# EAGLE design XFader_Assign (EAGLE 6.5.0)
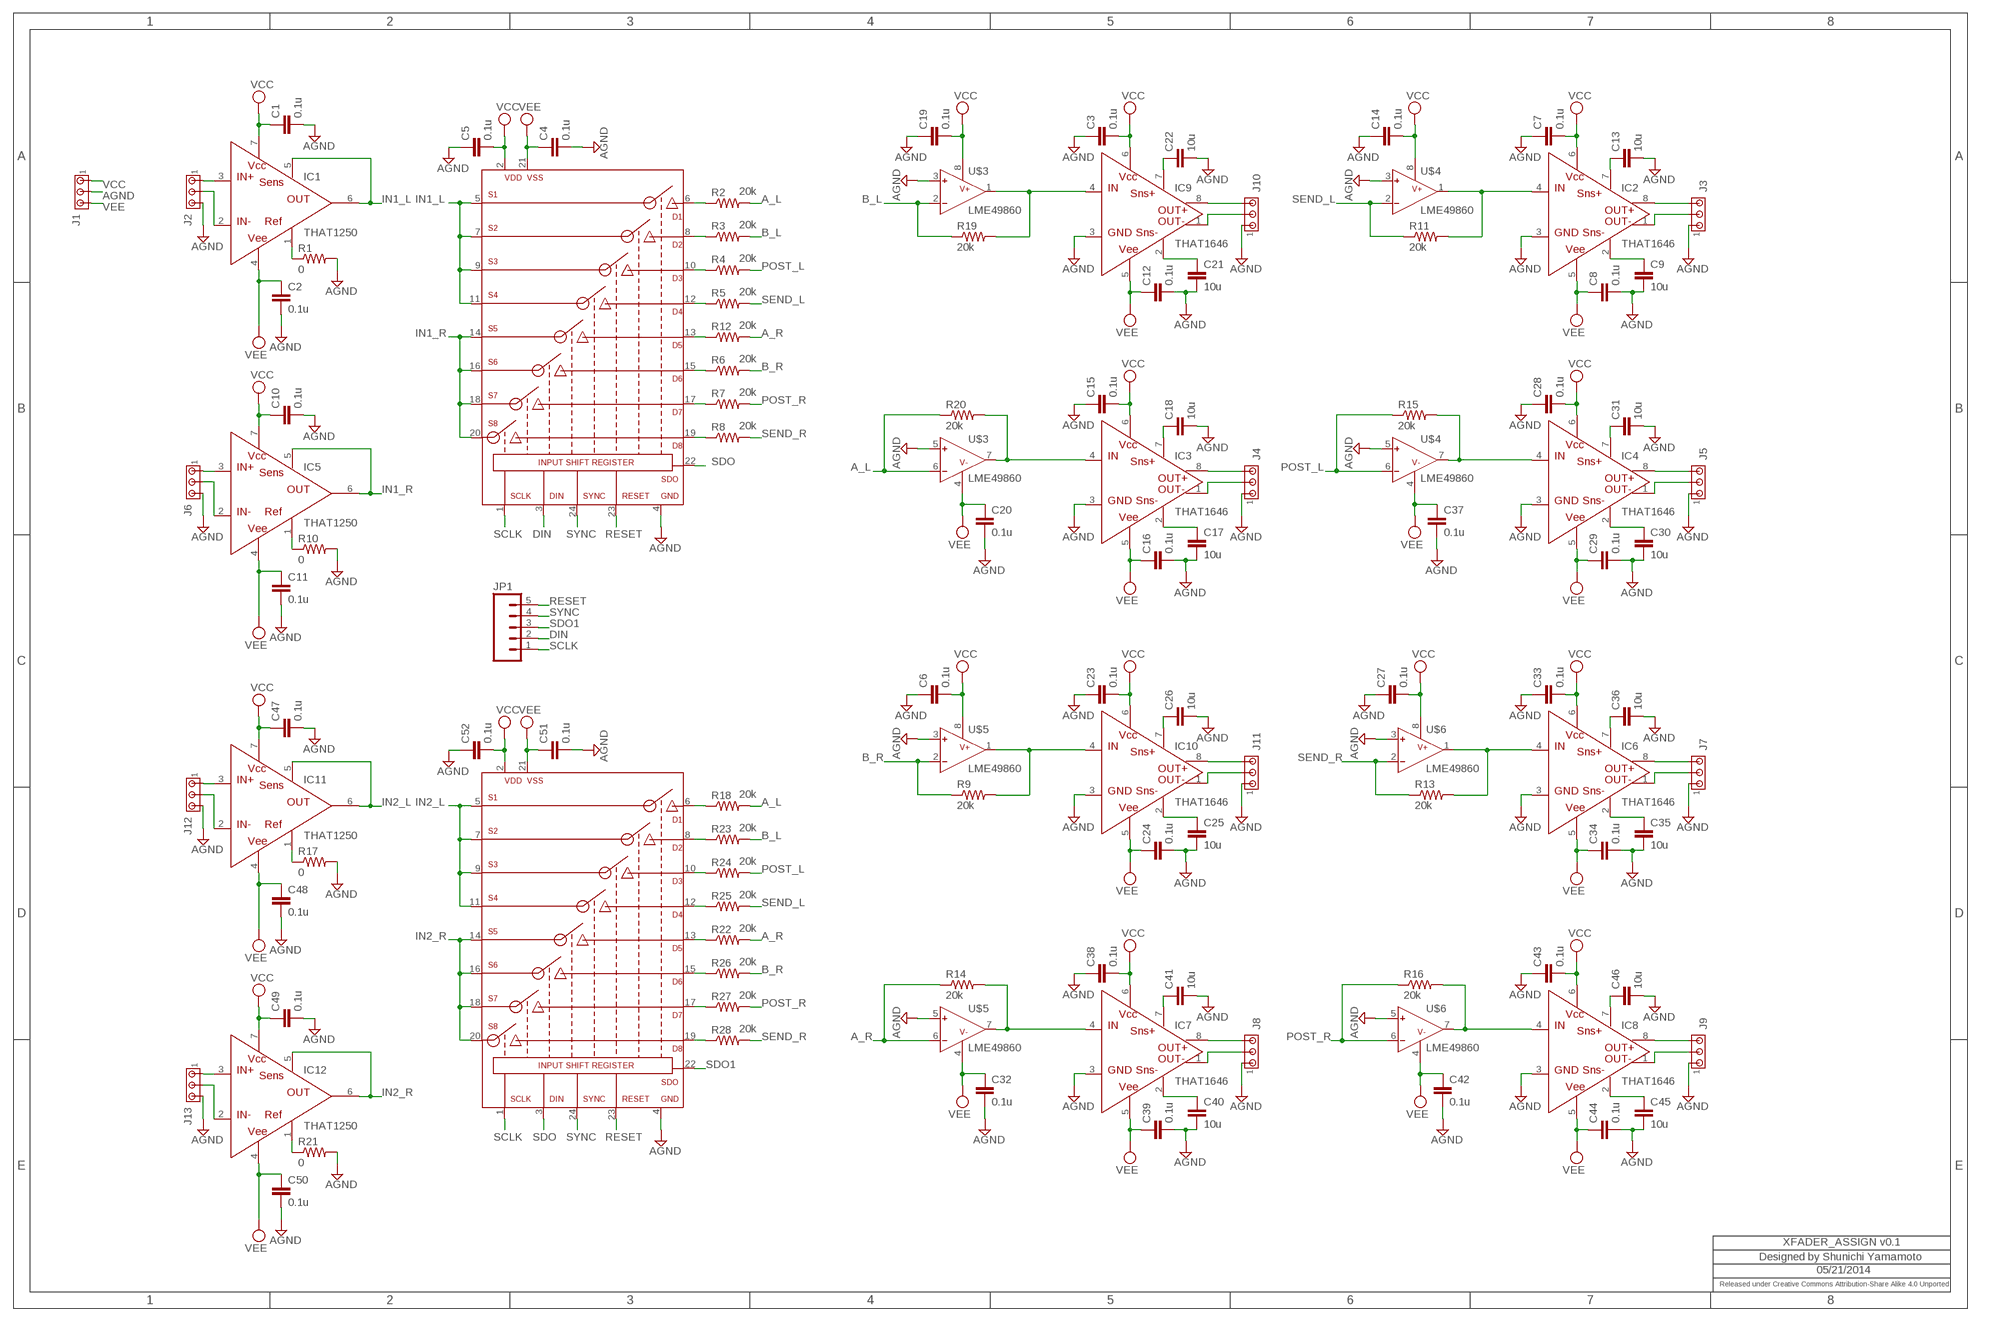
[diagram p0: schematic, sheet 1]

## Parts
C1  0.1u  C-EUC2012  [C2012]
C2  0.1u  C-EUC2012  [C2012]
C3  0.1u  C-EUC2012  [C2012]
C4  0.1u  C-EUC2012  [C2012]
C5  0.1u  C-EUC2012  [C2012]
C6  0.1u  C-EUC2012  [C2012]
C7  0.1u  C-EUC2012  [C2012]
C8  0.1u  C-EUC2012  [C2012]
C9  10u  C-EUC2012  [C2012]
C10  0.1u  C-EUC2012  [C2012]
C11  0.1u  C-EUC2012  [C2012]
C12  0.1u  C-EUC2012  [C2012]
C13  10u  C-EUC2012  [C2012]
C14  0.1u  C-EUC2012  [C2012]
C15  0.1u  C-EUC2012  [C2012]
C16  0.1u  C-EUC2012  [C2012]
C17  10u  C-EUC2012  [C2012]
C18  10u  C-EUC2012  [C2012]
C19  0.1u  C-EUC2012  [C2012]
C20  0.1u  C-EUC2012  [C2012]
C21  10u  C-EUC2012  [C2012]
C22  10u  C-EUC2012  [C2012]
C23  0.1u  C-EUC2012  [C2012]
C24  0.1u  C-EUC2012  [C2012]
C25  10u  C-EUC2012  [C2012]
C26  10u  C-EUC2012  [C2012]
C27  0.1u  C-EUC2012  [C2012]
C28  0.1u  C-EUC2012  [C2012]
C29  0.1u  C-EUC2012  [C2012]
C30  10u  C-EUC2012  [C2012]
C31  10u  C-EUC2012  [C2012]
C32  0.1u  C-EUC2012  [C2012]
C33  0.1u  C-EUC2012  [C2012]
C34  0.1u  C-EUC2012  [C2012]
C35  10u  C-EUC2012  [C2012]
C36  10u  C-EUC2012  [C2012]
C37  0.1u  C-EUC2012  [C2012]
C38  0.1u  C-EUC2012  [C2012]
C39  0.1u  C-EUC2012  [C2012]
C40  10u  C-EUC2012  [C2012]
C41  10u  C-EUC2012  [C2012]
C42  0.1u  C-EUC2012  [C2012]
C43  0.1u  C-EUC2012  [C2012]
C44  0.1u  C-EUC2012  [C2012]
C45  10u  C-EUC2012  [C2012]
C46  10u  C-EUC2012  [C2012]
C47  0.1u  C-EUC2012  [C2012]
C48  0.1u  C-EUC2012  [C2012]
C49  0.1u  C-EUC2012  [C2012]
C50  0.1u  C-EUC2012  [C2012]
C51  0.1u  C-EUC2012  [C2012]
C52  0.1u  C-EUC2012  [C2012]
IC1  THAT1250  [SOIC8@1]
IC2  THAT1646  [SOIC8]
IC3  THAT1646  [SOIC8]
IC4  THAT1646  [SOIC8]
IC5  THAT1250  [SOIC8@1]
IC6  THAT1646  [SOIC8]
IC7  THAT1646  [SOIC8]
IC8  THAT1646  [SOIC8]
IC9  THAT1646  [SOIC8]
IC10  THAT1646  [SOIC8]
IC11  THAT1250  [SOIC8@1]
IC12  THAT1250  [SOIC8@1]
J1  MTA03-156  [1X3MTA]
J2  MTA03-100  [10X03MTA]
J3  MTA03-100  [10X03MTA]
J4  MTA03-100  [10X03MTA]
J5  MTA03-100  [10X03MTA]
J6  MTA03-100  [10X03MTA]
J7  MTA03-100  [10X03MTA]
J8  MTA03-100  [10X03MTA]
J9  MTA03-100  [10X03MTA]
J10  MTA03-100  [10X03MTA]
J11  MTA03-100  [10X03MTA]
J12  MTA03-100  [10X03MTA]
J13  MTA03-100  [10X03MTA]
JP1  M05PTH  [1X05]
R1  0  RESISTOR0805-RES  [0805]
R2  20k  RESISTOR0805-RES  [0805]
R3  20k  RESISTOR0805-RES  [0805]
R4  20k  RESISTOR0805-RES  [0805]
R5  20k  RESISTOR0805-RES  [0805]
R6  20k  RESISTOR0805-RES  [0805]
R7  20k  RESISTOR0805-RES  [0805]
R8  20k  RESISTOR0805-RES  [0805]
R9  20k  RESISTOR0805-RES  [0805]
R10  0  RESISTOR0805-RES  [0805]
R11  20k  RESISTOR0805-RES  [0805]
R12  20k  RESISTOR0805-RES  [0805]
R13  20k  RESISTOR0805-RES  [0805]
R14  20k  RESISTOR0805-RES  [0805]
R15  20k  RESISTOR0805-RES  [0805]
R16  20k  RESISTOR0805-RES  [0805]
R17  0  RESISTOR0805-RES  [0805]
R18  20k  RESISTOR0805-RES  [0805]
R19  20k  RESISTOR0805-RES  [0805]
R20  20k  RESISTOR0805-RES  [0805]
R21  0  RESISTOR0805-RES  [0805]
R22  20k  RESISTOR0805-RES  [0805]
R23  20k  RESISTOR0805-RES  [0805]
R24  20k  RESISTOR0805-RES  [0805]
R25  20k  RESISTOR0805-RES  [0805]
R26  20k  RESISTOR0805-RES  [0805]
R27  20k  RESISTOR0805-RES  [0805]
R28  20k  RESISTOR0805-RES  [0805]
U$1  ADG1414  [TSSOP24]
U$2  ADG1414  [TSSOP24]
U$3  LME49860  [SOIC8]
U$4  LME49860  [SOIC8]
U$5  LME49860  [SOIC8]
U$6  LME49860  [SOIC8]

## Nets
A_L: R2.2 R18.2 R20.1 U$3.6(INB-)
A_R: R12.2 R14.1 R22.2 U$5.6(INB-)
AGND: C1.2 C2.2 C3.1 C4.2 C5.1 C6.1 C7.1 C8.2 C9.2 C10.2 C11.2 C12.2 C13.2 C14.1 C15.1 C16.2 C17.2 C18.2 C19.1 C20.2 C21.2 C22.2 C23.1 C24.2 C25.2 C26.2 C27.1 C28.1 C29.2 C30.2 C31.2 C32.2 C33.1 C34.2 C35.2 C36.2 C37.2 C38.1 C39.2 C40.2 C41.2 C42.2 C43.1 C44.2 C45.2 C46.2 C47.2 C48.2 C49.2 C50.2 C51.2 C52.1 IC2.3(GND) IC3.3(GND) IC4.3(GND) IC6.3(GND) IC7.3(GND) IC8.3(GND) IC9.3(GND) IC10.3(GND) J1.2 J2.3 J3.1 J4.1 J5.1 J6.3 J7.1 J8.1 J9.1 J10.1 J11.1 J12.3 J13.3 R1.2 R10.2 R17.2 R21.2 U$1.4(GND) U$2.4(GND) U$3.3(INA+) U$3.5(INB+) U$4.3(INA+) U$4.5(INB+) U$5.3(INA+) U$5.5(INB+) U$6.3(INA+) U$6.5(INB+)
B_L: R3.2 R19.1 R23.2 U$3.2(INA-)
B_R: R6.2 R9.1 R26.2 U$5.2(INA-)
DIN: JP1.2 U$1.3(DIN)
IN1_L: IC1.5(SENS) IC1.6(OUT) U$1.5(S1) U$1.7(S2) U$1.9(S3) U$1.11(S4)
IN1_R: IC5.5(SENS) IC5.6(OUT) U$1.14(S5) U$1.16(S6) U$1.18(S7) U$1.20(S8)
IN2_L: IC11.5(SENS) IC11.6(OUT) U$2.5(S1) U$2.7(S2) U$2.9(S3) U$2.11(S4)
IN2_R: IC12.5(SENS) IC12.6(OUT) U$2.14(S5) U$2.16(S6) U$2.18(S7) U$2.20(S8)
MGAIN_L1: IC10.4(IN) R9.2 U$5.1(OUTA)
MGAIN_L2: IC9.4(IN) R19.2 U$3.1(OUTA)
MGAIN_L3: IC2.4(IN) R11.2 U$4.1(OUTA)
MGAIN_L4: IC6.4(IN) R13.2 U$6.1(OUTA)
MGAIN_R: IC3.4(IN) R20.2 U$3.7(OUTB)
MGAIN_R1: IC7.4(IN) R14.2 U$5.7(OUTB)
MGAIN_R2: IC4.4(IN) R15.2 U$4.7(OUTB)
MGAIN_R3: IC8.4(IN) R16.2 U$6.7(OUTB)
N$1: IC1.1(REF) R1.1
N$2: R2.1 U$1.6(D1)
N$3: IC1.3(IN+) J2.1
N$4: IC1.2(IN-) J2.2
N$5: R12.1 U$1.13(D5)
N$6: R3.1 U$1.8(D2)
N$7: R4.1 U$1.10(D3)
N$8: R5.1 U$1.12(D4)
N$9: R6.1 U$1.15(D6)
N$10: R7.1 U$1.17(D7)
N$11: R8.1 U$1.19(D8)
N$12: C13.1 IC2.7(SNS+)
N$13: IC5.1(REF) R10.1
N$14: IC5.3(IN+) J6.1
N$15: IC5.2(IN-) J6.2
N$16: C9.1 IC2.2(SNS-)
N$17: IC2.8(OUT+) J3.3
N$18: IC2.1(OUT-) J3.2
N$19: C18.1 IC3.7(SNS+)
N$20: C17.1 IC3.2(SNS-)
N$21: IC3.8(OUT+) J4.3
N$22: IC3.1(OUT-) J4.2
N$23: C31.1 IC4.7(SNS+)
N$24: C30.1 IC4.2(SNS-)
N$25: C22.1 IC9.7(SNS+)
N$26: IC9.8(OUT+) J10.3
N$27: IC9.1(OUT-) J10.2
N$28: C26.1 IC10.7(SNS+)
N$29: C25.1 IC10.2(SNS-)
N$30: IC10.8(OUT+) J11.3
N$31: IC10.1(OUT-) J11.2
N$32: IC4.8(OUT+) J5.3
N$33: IC4.1(OUT-) J5.2
N$34: C21.1 IC9.2(SNS-)
N$35: C36.1 IC6.7(SNS+)
N$36: C35.1 IC6.2(SNS-)
N$37: IC6.8(OUT+) J7.3
N$38: IC6.1(OUT-) J7.2
N$39: C41.1 IC7.7(SNS+)
N$40: C40.1 IC7.2(SNS-)
N$41: IC7.8(OUT+) J8.3
N$42: IC7.1(OUT-) J8.2
N$43: C46.1 IC8.7(SNS+)
N$44: C45.1 IC8.2(SNS-)
N$45: IC8.8(OUT+) J9.3
N$46: IC8.1(OUT-) J9.2
N$47: IC11.1(REF) R17.1
N$48: IC11.3(IN+) J12.1
N$49: IC11.2(IN-) J12.2
N$50: IC12.1(REF) R21.1
N$51: IC12.3(IN+) J13.1
N$52: IC12.2(IN-) J13.2
N$53: R18.1 U$2.6(D1)
N$54: R22.1 U$2.13(D5)
N$55: R23.1 U$2.8(D2)
N$56: R24.1 U$2.10(D3)
N$57: R25.1 U$2.12(D4)
N$58: R26.1 U$2.15(D6)
N$59: R27.1 U$2.17(D7)
N$60: R28.1 U$2.19(D8)
POST_L: R4.2 R15.1 R24.2 U$4.6(INB-)
POST_R: R7.2 R16.1 R27.2 U$6.6(INB-)
RESET: JP1.5 U$1.23(RESET) U$2.23(RESET)
SCLK: JP1.1 U$1.1(SCLK) U$2.1(SCLK)
SDO: U$1.22(SDO) U$2.3(DIN)
SDO1: JP1.3 U$2.22(SDO)
SEND_L: R5.2 R11.1 R25.2 U$4.2(INA-)
SEND_R: R8.2 R13.1 R28.2 U$6.2(INA-)
SYNC: JP1.4 U$1.24(SYNC) U$2.24(SYNC)
VCC: C1.1 C3.2 C5.2 C6.2 C7.2 C10.1 C14.2 C15.2 C19.2 C23.2 C27.2 C28.2 C33.2 C38.2 C43.2 C47.1 C49.1 C52.2 IC1.7(VCC) IC2.6(VCC) IC3.6(VCC) IC4.6(VCC) IC5.7(VCC) IC6.6(VCC) IC7.6(VCC) IC8.6(VCC) IC9.6(VCC) IC10.6(VCC) IC11.7(VCC) IC12.7(VCC) J1.1 U$1.2(VDD) U$2.2(VDD) U$3.8(V+) U$4.8(V+) U$5.8(V+) U$6.8(V+)
VEE: C2.1 C4.1 C8.1 C11.1 C12.1 C16.1 C20.1 C24.1 C29.1 C32.1 C34.1 C37.1 C39.1 C42.1 C44.1 C48.1 C50.1 C51.1 IC1.4(VEE) IC2.5(VEE) IC3.5(VEE) IC4.5(VEE) IC5.4(VEE) IC6.5(VEE) IC7.5(VEE) IC8.5(VEE) IC9.5(VEE) IC10.5(VEE) IC11.4(VEE) IC12.4(VEE) J1.3 U$1.21(VSS) U$2.21(VSS) U$3.4(V-) U$4.4(V-) U$5.4(V-) U$6.4(V-)

## Notes on the sheet
- XFADER_ASSIGN v0.1
- Designed by Shunichi Yamamoto
- 05/21/2014
- Released under Creative Commons Attribution-Share Alike 4.0 Unported

## Library data of the parts
C1-C52 = rcl:C-EU: CAPACITOR, European symbol
IC1 IC5 IC11 IC12 = thatcorp:THAT1250
IC2-IC4 IC6-IC10 = thatcorp:THAT1646
J1 = con-amp:MTA03-156: AMP connector
J2-J13 = con-amp:MTA03-100: AMP connector
JP1 = SparkFun:M05: Header 5 Standard 5-pin 0.1" header. Use with straight break away headers (SKU : PRT-00116), right angle break away headers (PRT-00553), swiss pins (PRT-00743), machine pins (PRT-00117), and female headers (PRT-00115). Molex polarized connector foot print use with SKU : PRT-08230 with associated crimp pins and housings.
R1-R28 = SparkFun:RESISTOR: Resistor Basic schematic elements and footprints for 0603, 1206, and PTH resistors.
U$1 U$2 = thatcorp:ADG1414
U$3-U$6 = thatcorp:LME49860

## Board
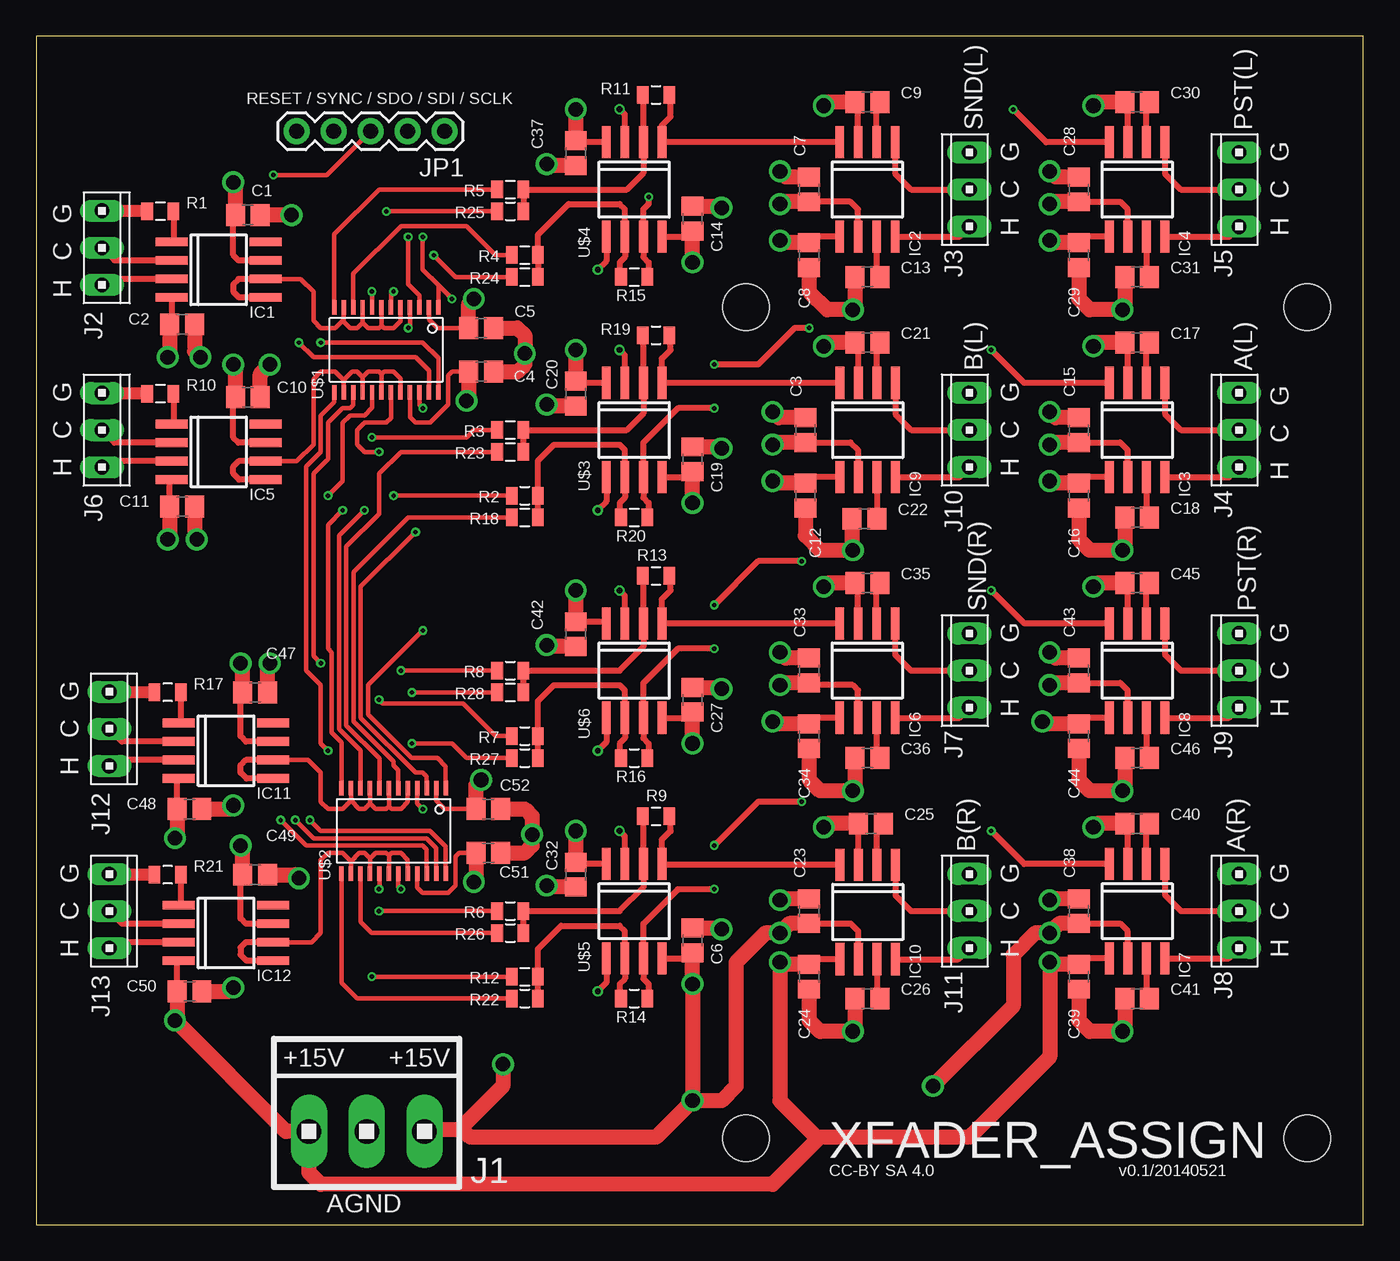
[diagram p1: board, top side]
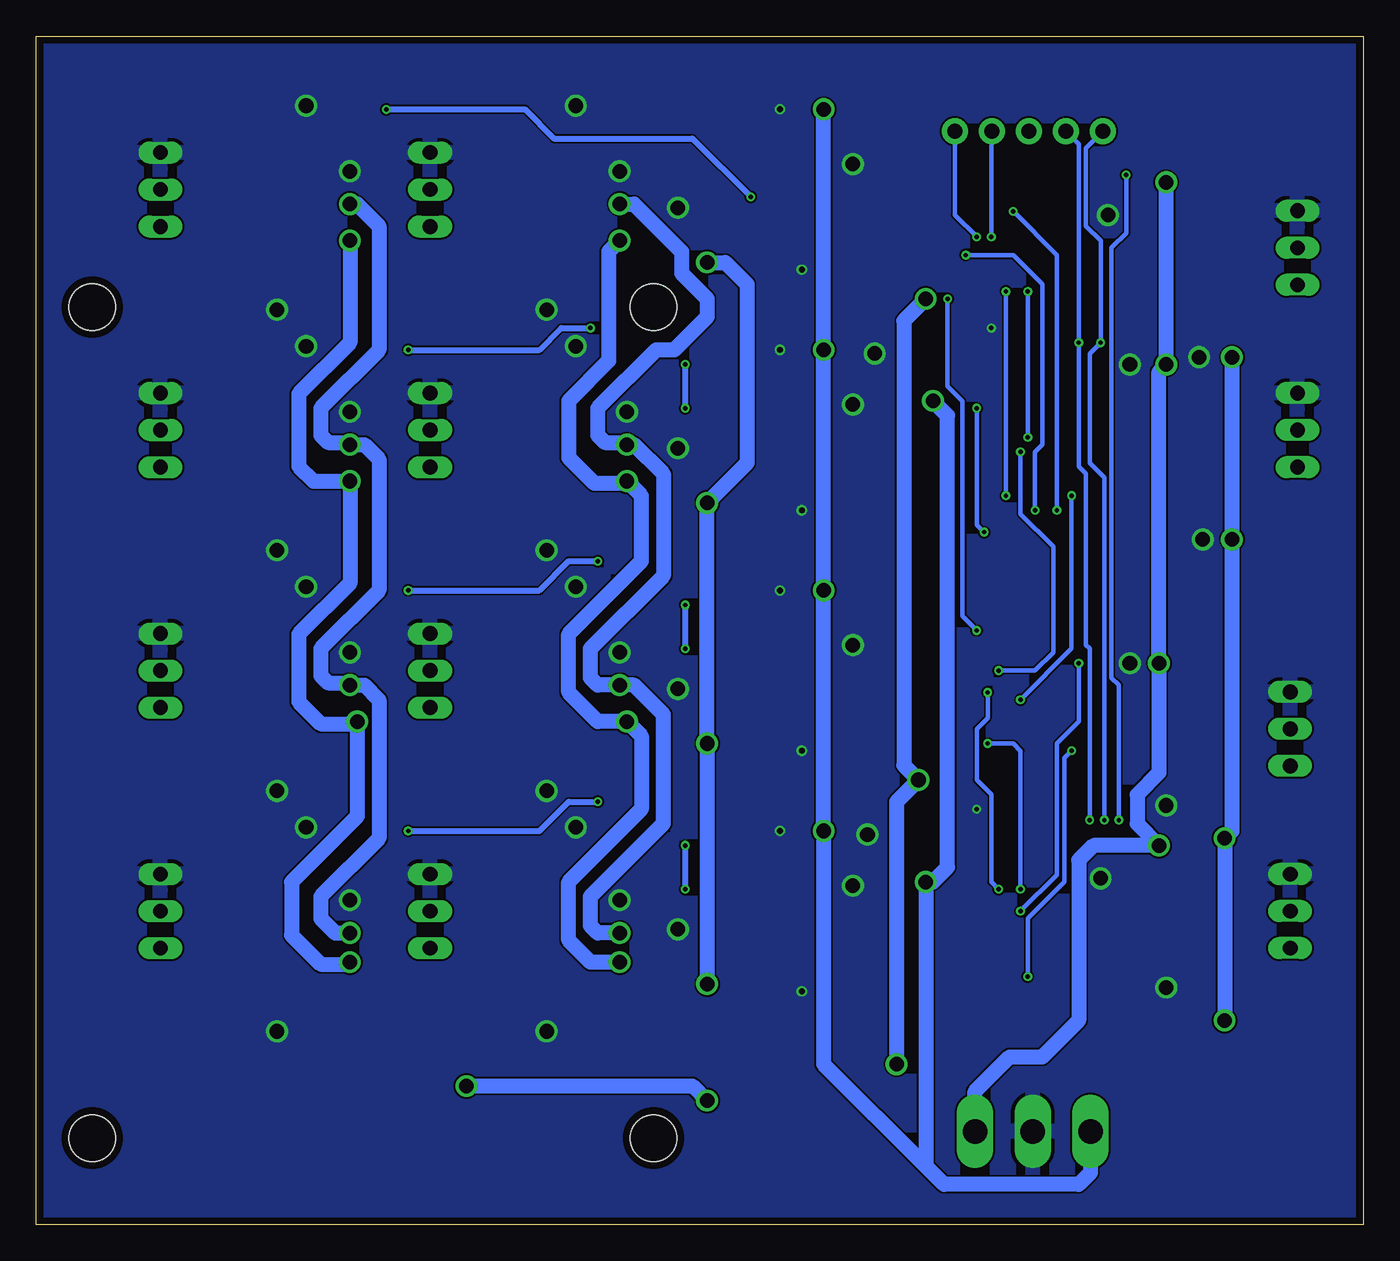
[diagram p2: board, bottom side, seen from below]

Size 91 x 81.5 mm. Coordinates in mm from the lower left corner, seen from the top.
Outline: 0,0 91,0 91,81.5 0,81.5 0,0
Copper layers (1+2*3+16): Top 0.018mm / dielectric 0.25mm / Route2 0.035mm / dielectric 1mm / Route3 0.035mm / dielectric 0.2mm / Bottom 0.018mm
Design rules "pban_5mil-l4-a": minimum track width 5mil, minimum drill 0.3mm, track to track 5mil, track to pad 0.229mm, pad to pad 5mil, via to via 5mil, smd to smd 5mil, copper to edge 0.5mm, drill to drill 0.5mm, minimum pad ring 0.15mm, minimum via ring 0.15mm, stop-mask expansion 4mil, vias tented up to drill 0.35mm, thermal gap 10mil
Holes 3.2 mm at 48.67,62.92 87.17,62.92 87.17,5.92 48.67,5.92

### Footprints (pad centres in the part's own frame; a part is rotated, then mirrored left to right if it is on the bottom)
C2012 = smd 1.3 x 1.5: 1 -0.85,0; 2 0.85,0
SOIC8@1 = smd 0.6 x 2.2: 1 -1.905,-3.235; 2 -0.635,-3.235; 3 0.635,-3.235; 4 1.905,-3.235; 5 1.905,3.235; 6 0.635,3.235; 7 -0.635,3.235; 8 -1.905,3.235
SOIC8 = smd 0.6 x 2.2: 1 -1.905,-3.235; 2 -0.635,-3.235; 3 0.635,-3.235; 4 1.905,-3.235; 5 1.905,3.235; 6 0.635,3.235; 7 -0.635,3.235; 8 -1.905,3.235
1X3MTA = drill 1.676 long: 1 3.937,0; 2 -0.025,0; 3 -3.988,0
10X03MTA = drill 1.016 long: 1 2.54,0; 2 0,0; 3 -2.54,0
1X05 = drill 1.016 pad 1.778: 1 0,0; 2 2.54,0; 3 5.08,0; 4 7.62,0; 5 10.16,0
0805 = smd 0.8 x 1.2: 1 -0.9,0; 2 0.9,0
TSSOP24 = smd 0.305 x 0.991: 1 -3.575,-2.918; 2 -2.925,-2.918; 3 -2.275,-2.918; 4 -1.625,-2.918; 5 -0.975,-2.918; 6 -0.325,-2.918; 7 0.325,-2.918; 8 0.975,-2.918; 9 1.625,-2.918; 10 2.275,-2.918; 11 2.925,-2.918; 12 3.575,-2.918; 13 3.575,2.918; 14 2.925,2.918; 15 2.275,2.918; 16 1.625,2.918; 17 0.975,2.918; 18 0.325,2.918; 19 -0.325,2.918; 20 -0.975,2.918; 21 -1.625,2.918; 22 -2.275,2.918; 23 -2.925,2.918; 24 -3.575,2.918

### Placement (x,y rotation side)
C1  14.5,69.25 0 top
C2  10,61.75 0 top
C3  52.75,54.5 270 top
C4  30.5,58.5 0 top
C5  30.5,61.5 180 top
C6  45,19.5 270 top
C7  53,71 270 top
C8  53,66.5 270 top
C9  57,77 180 top
C10  14.5,56.75 0 top
C11  10,49.25 0 top
C12  52.75,50 270 top
C13  57,65 180 top
C14  45,69 270 top
C15  71.5,54.5 270 top
C16  71.5,50 270 top
C17  75.5,60.5 180 top
C18  75.5,48.5 180 top
C19  45,52.5 270 top
C20  37,57 270 top
C21  57,60.5 180 top
C22  56.8,48.41 180 top
C23  53,21.5 270 top
C24  53,17 270 top
C25  57.25,27.5 180 top
C26  57,15.5 180 top
C27  45,36 270 top
C28  71.5,71 270 top
C29  71.5,66.5 270 top
C30  75.5,77 180 top
C31  75.5,65 180 top
C32  37,24 270 top
C33  53,38 270 top
C34  53,33.5 270 top
C35  57,44 180 top
C36  57,32 180 top
C37  37,73.5 270 top
C38  71.5,21.5 270 top
C39  71.5,17 270 top
C40  75.5,27.5 180 top
C41  75.5,15.5 180 top
C42  37,40.5 270 top
C43  71.5,38 270 top
C44  71.5,33.5 270 top
C45  75.5,44 180 top
C46  75.5,32 180 top
C47  15,36.5 0 top
C48  10.5,28.5 0 top
C49  15,24 0 top
C50  10.5,16 0 top
C51  31,25.5 0 top
C52  31,28.5 180 top
IC1  12.5,65.5 270 top
IC2  57,71 180 top
IC3  75.5,54.5 180 top
IC4  75.5,71 180 top
IC5  12.5,53 270 top
IC6  57,38 180 top
IC7  75.5,21.5 180 top
IC8  75.5,38 180 top
IC9  57.02,54.5 180 top
IC10  57.02,21.44 180 top
IC11  13,32.5 270 top
IC12  13,20 270 top
J1  22.68,6.39 0 top
J2  4.5,67 270 top
J3  64,71 90 top
J4  82.5,54.5 90 top
J5  82.5,71 90 top
J6  4.5,54.5 270 top
J7  64,38 90 top
J8  82.5,21.5 90 top
J9  82.5,38 90 top
J10  64,54.5 90 top
J11  64,21.5 90 top
J12  5,34 270 top
J13  5,21.5 270 top
JP1  28,75 180 top
R1  8.5,69.5 180 top
R2  33.5,50 0 top
R3  32.5,54.5 0 top
R4  33.5,66.5 0 top
R5  32.5,71 0 top
R6  32.5,21.5 0 top
R7  33.5,33.5 0 top
R8  32.5,38 0 top
R9  42.5,28 0 top
R10  8.5,57 180 top
R11  42.5,77.5 0 top
R12  33.5,17 0 top
R13  42.5,44.5 0 top
R14  41,15.5 0 top
R15  41,65 0 top
R16  41,32 0 top
R17  9,36.5 180 top
R18  33.5,48.5 0 top
R19  42.5,61 0 top
R20  41,48.5 0 top
R21  9,24 180 top
R22  33.5,15.5 0 top
R23  32.5,53 0 top
R24  33.5,65 0 top
R25  32.5,69.5 0 top
R26  32.5,20 0 top
R27  33.5,32 0 top
R28  32.5,36.5 0 top
U$1  24,60 180 top
U$2  24.5,27 180 top
U$3  41,54.5 180 top
U$4  41,71 180 top
U$5  41,21.5 180 top
U$6  41,38 180 top

### Tracks (layer width: path | path; a pad name or v marks a point on that pad's centre or on a via)
A_L
  Top 0.406: R20.1 40,48.1 40,49.5 40.37,49.87 U$3.6 40.37,53.13 40,53.5 35.5,53.5 34.4,52.4 R2.2 R18.2
A_R
  Top 0.406: R14.1 40,15.6 40,16.5 40.37,16.86 U$5.6 40.37,20.14 40,20.5 36,20.5 34.4,18.9 R12.2 R22.2
AGND  (via drill 0.3, 0.4, 1)
  Top 0.305: U$2.4 26.12,28.88 v26.5,28.5 | U$1.4 25.62,61.62 v25.5,61.5
  Top 0.406: IC2.3 56.37,76.78 C9.2 | IC4.3 74.86,76.78 C30.2 | IC9.3 56.38,60.27 C21.2 | IC3.3 74.86,60.28 C17.2 | IC10.3 56.38,27.48 C25.2 | IC7.3 74.86,27.29 C40.2 | IC8.3 74.86,43.78 C45.2 | U$5.5 39.09,16.59 v38.5,16 | U$5.3 40.37,26.64 v40,27 | U$6.5 39.09,33.09 v38.5,32.5 | U$6.3 40.37,43.13 v40,43.5 | U$3.5 39.09,49.59 v38.5,49 | U$3.3 40.37,59.63 v40,60 | U$4.5 39.09,66.09 v38.5,65.5 | U$4.3 40.37,76.14 v40,76.5 | IC6.3 56.37,43.78 C35.2
  Top 0.813: R1.2 4.54,69.5 J2.3 | R10.2 4.54,57 J6.3 | R21.2 5.04,24 J13.3 | J12.3 8.06,36.54 R17.2
  Top 1.016: v17.5,69.25 C1.2 | C5.1 33,61.5 33.5,61 v33.5,59.75 33.5,59 33,58.5 C4.2 | C52.1 33.5,28.5 34,28 v34,26.75 34,26 33.5,25.5 C51.2 | C48.2 13.25,28.5 v13.5,28.75 | C49.2 17.75,24 v18,23.75 | C50.2 13.25,16 v13.5,16.25 | C6.1 46.9,20.35 v47,20.25 | C37.2 35.1,72.65 v35,72.75 | C14.1 46.9,69.85 v47,69.75 | C20.2 35.1,56.15 v35,56.25 | C19.1 46.9,53.35 v47,53.25 | C42.2 35.1,39.65 v35,39.75 | C27.1 46.9,36.85 v47,36.75 | C32.2 35.1,23.15 v35,23.25 | C13.2 56.15,62.9 v56,62.75 54.25,62.75 53,64 C8.2 | C31.2 74.65,62.9 v74.5,62.75 72.25,62.75 71.5,63.5 C29.2 | C9.2 54.25,77 v54,76.75 | C30.2 72.75,77 v72.5,76.75 | C7.1 51.4,71.85 v51,72.25 | C28.1 69.9,71.85 v69.5,72.25 | C26.2 56.15,13.4 v56,13.25 53.75,13.25 53,14 C24.2 | C41.2 74.65,13.4 v74.5,13.25 72.25,13.25 71.5,14 C39.2 | C23.1 51.1,22.35 v51,22.25 | C25.2 54.25,27.5 v54,27.25 | C38.1 69.6,22.35 v69.5,22.25 | C40.2 72.75,27.5 v72.5,27.25 | C36.2 56.15,29.9 v56,29.75 53.75,29.75 53,30.5 C34.2 | C46.2 74.65,29.9 v74.5,29.75 72.25,29.75 71.5,30.5 C44.2 | C43.1 69.9,38.85 v69.5,39.25 | C33.1 51.4,38.85 v51,39.25 | C35.2 54.25,44 v54,43.75 | C45.2 72.75,44 v72.5,43.75 | C22.2 55.95,46.3 v56,46.25 53.75,46.25 52.75,47.25 C12.2 | C18.2 74.65,46.4 v74.5,46.25 72.25,46.25 71.5,47 C16.2 | C15.1 69.9,55.35 v69.5,55.75 | C21.2 54.25,60.5 v54,60.25 | C17.2 72.75,60.5 v72.5,60.25 | C3.1 50.9,55.35 v50.5,55.75 | C11.2 10.85,47.15 v11,47 | C2.2 10.85,59.9 v11.25,59.5 | C10.2 15.35,58.35 v16,59 | C47.2 15.85,38.35 v16,38.5
  pour Bottom: 0,0 91,0 91,81.5 0,81.5
B_L
  Top 0.406: R19.1 41.63,60.47 U$3.2 41.63,55.63 40.5,54.5 R3.2 R23.2
B_R
  Top 0.406: R9.1 41.63,27.96 U$5.2 41.63,23.14 40,21.5 R6.2 R26.2
DIN  (via drill 0.3)
  Top 0.305: U$1.3 26.27,63.73 25.5,64.5 v25.5,67.75
  Bottom 0.305: v25.5,67.75 25.5,74.96 JP1.2
IN1_L
  Top 0.305: U$1.11 21.07,62.08 | 21.07,62.08 20.5,61.5 19.5,61.5 19,62 19,64 18.14,64.86 IC1.6 | U$1.9 22.38,61.88 | 22.38,61.88 22,61.5 21.5,61.5 21.07,61.92 21.07,62.08 | U$1.7 23.68,61.67 | 23.68,61.67 23.5,61.5 22.75,61.5 22.38,61.88 | U$1.5 24.98,61.98 24.5,61.5 23.85,61.5 23.68,61.67
  Top 0.406: IC1.5 13.9,63.59 13.5,64 13.5,64.5 13.87,64.86 IC1.6
IN1_R
  Top 0.305: IC5.6 17.86,52.37 19,53.5 19,58 19.5,58.5 20.5,58.5 21.07,57.92 | U$1.14 21.07,57.92 | U$1.16 22.38,58.12 | 22.38,58.12 22,58.5 21.65,58.5 21.07,57.92 | U$1.18 23.68,58.33 | 23.68,58.33 23.5,58.5 22.75,58.5 22.38,58.12 | U$1.20 24.98,58.02 24.5,58.5 23.85,58.5 23.68,58.33
  Top 0.406: IC5.6 13.87,52.37 13.5,52 13.5,51.5 13.9,51.09 IC5.5
IN2_L
  Top 0.305: IC11.6 18.64,31.86 19.5,31 19.5,29 20,28.5 21,28.5 21.57,29.07 | U$2.11 21.57,29.07 | U$2.9 22.88,28.88 | 22.88,28.88 22.5,28.5 22.15,28.5 21.57,29.07 | U$2.7 24.18,28.68 | 24.18,28.68 24,28.5 23.25,28.5 22.88,28.88 | U$2.5 25.48,28.98 25,28.5 24.35,28.5 24.18,28.68
  Top 0.406: IC11.6 14.37,31.86 14,31.5 14,31 14.4,30.59 IC11.5
IN2_R
  Top 0.305: IC12.6 18.86,19.36 19.5,20 19.5,25 20,25.5 21,25.5 21.57,24.93 | U$2.14 21.57,24.93 | U$2.16 22.88,25.12 | 22.88,25.12 22.5,25.5 22.15,25.5 21.57,24.93 | U$2.18 24.18,25.32 | 24.18,25.32 24,25.5 23.25,25.5 22.88,25.12 | U$2.20 25.48,25.02 25,25.5 24.35,25.5 24.18,25.32
  Top 0.406: IC12.5 14.4,18.09 14,18.5 14,19 14.37,19.36 IC12.6
MGAIN_L1
  Top 0.406: R9.2 43.5,27.9 43.5,27 42.91,26.41 U$5.1 42.97,24.68 IC10.4
MGAIN_L2
  Top 0.406: R19.2 43.5,60.9 43.5,60 42.91,59.41 U$3.1 IC9.4
MGAIN_L3
  Top 0.406: R11.2 43.5,77.4 43.5,76 42.91,75.41 U$4.1 IC2.4
MGAIN_L4
  Top 0.406: R13.2 43.5,44.4 43.5,43.5 42.91,42.91 U$6.1 IC6.4
MGAIN_R  (via drill 0.3)
  Top 0.406: R20.2 42,48.1 42,49.5 41.63,49.87 U$3.7 41.63,53.63 44,56 v46.5,56 | IC3.4 67.77,57.73 v65.5,60 | v53,61.5 52,61.5 49.5,59 v46.5,59
  Bottom 0.406: v65.5,60 56.5,60 55,61.5 v53,61.5 | v46.5,59 v46.5,56
MGAIN_R1  (via drill 0.3)
  Top 0.406: R14.2 42,15.6 42,16.5 41.63,16.86 U$5.7 41.63,20.64 44,23 v46.5,23 | IC7.4 67.77,24.73 v65.5,27 | v52.5,29 49.5,29 v46.5,26
  Bottom 0.406: v65.5,27 56.5,27 54.5,29 v52.5,29 | v46.5,26 v46.5,23
MGAIN_R2  (via drill 0.3)
  Top 0.406: R15.2 42,65.1 42,66 41.63,66.36 U$4.7 41.63,69.64 42,70 v42,70.5 | IC4.4 69.27,74.23 v67,76.5
  Bottom 0.406: v67,76.5 57.5,76.5 55.5,74.5 46,74.5 v42,70.5
MGAIN_R3  (via drill 0.3)
  Top 0.406: R16.2 42,32.1 42,33 41.63,33.37 U$6.7 41.63,37.13 44,39.5 v46.5,39.5 | IC8.4 67.77,41.23 v65.5,43.5 | v52.5,45.5 49.5,45.5 v46.5,42.5
  Bottom 0.406: v65.5,43.5 56.5,43.5 54.5,45.5 v52.5,45.5 | v46.5,42.5 v46.5,39.5
N$1
  Top 0.406: R1.1 9.4,67.54 IC1.1
N$2  (via drill 0.3)
  Top 0.305: U$1.6 24.32,63.83 v24.5,64 | v24.5,50 R2.1
  Bottom 0.305: v24.5,64 v24.5,50
N$3
  Top 0.406: IC1.3 4.9,64.86 J2.1
N$4
  Top 0.406: IC1.2 5.37,66.14 J2.2
N$5  (via drill 0.3)
  Top 0.305: v23,17 R12.1 | U$1.13 20.43,56.42 19.5,55.5 19.5,53 18.5,52 18.5,38 19.5,37 19.5,33 v20,32.5
  Bottom 0.305: v20,32.5 20.5,32 20.5,23.5 23,21 v23,17
N$6  (via drill 0.3)
  Top 0.305: U$1.8 23.02,63.98 v23,64 | v23,54 29.5,54 30,54.5 R3.1
  Bottom 0.305: v23,64 v23,54
N$7
  Top 0.305: U$1.10 21.73,65.22 25,68.5 29.5,68.5 31.5,66.5 R4.1
N$8
  Top 0.305: R5.1 23.5,71 20.43,67.92 U$1.12
N$9  (via drill 0.3)
  Top 0.305: v23.5,21.5 R6.1 | v19.5,38.5 19,39 19,51.5 20,52.5 20,55 21,56 21.5,56 21.73,56.23 U$1.15
  Bottom 0.305: v19.5,38.5 19.5,34.5 21,33 21,24 v23.5,21.5
N$10  (via drill 0.3)
  Top 0.305: U$1.17 23.02,56.02 22.5,55.5 21.5,55.5 21,55 21,51 v20,50 | R7.1 31.5,33.5 29.25,35.75 23.75,35.75 v23.5,36
  Bottom 0.305: v20,50 20,39.5 v23.5,36
N$11  (via drill 0.3)
  Top 0.305: U$1.19 24.32,55.33 24,55 22.5,55 22,54.5 22,53.5 22.5,53 v23.5,53 | v25,38 R8.1
  Bottom 0.305: v23.5,53 23.5,48.75 21.25,46.5 21.25,39.25 22.5,38 v25,38
N$12
  Top 0.406: IC2.7 57.63,65.22 C13.1
N$13
  Top 0.406: R10.1 9.4,55.04 IC5.1
N$14
  Top 0.406: IC5.3 4.9,52.37 J6.1
N$15
  Top 0.406: IC5.2 5.37,53.63 J6.2
N$16
  Top 0.406: IC2.2 57.63,76.78 C9.1
N$17
  Top 0.406: IC2.8 63.3,67.77 J3.3
N$18
  Top 0.406: IC2.1 58.91,72.09 60,71 J3.2
N$19
  Top 0.406: IC3.7 76.14,48.72 C18.1
N$20
  Top 0.406: IC3.2 76.14,60.28 C17.1
N$21
  Top 0.406: IC3.8 81.81,51.27 J4.3
N$22
  Top 0.406: IC3.1 77.41,55.59 78.5,54.5 J4.2
N$23
  Top 0.406: IC4.7 76.14,65.22 C31.1
N$24
  Top 0.406: IC4.2 76.14,76.78 C30.1
N$25
  Top 0.406: IC9.7 C22.1
N$26
  Top 0.406: IC9.8 63.3,51.27 J10.3
N$27
  Top 0.406: IC9.1 58.92,55.58 60,54.5 J10.2
N$28
  Top 0.406: IC10.7 57.66,15.7 C26.1
N$29
  Top 0.406: IC10.2 57.66,27.05 C25.1
N$30
  Top 0.406: IC10.8 63.24,18.2 J11.3
N$31
  Top 0.406: IC10.1 58.92,22.57 60,21.5 J11.2
N$32
  Top 0.406: IC4.8 81.81,67.77 J5.3
N$33
  Top 0.406: IC4.1 77.41,72.09 78.5,71 J5.2
N$34
  Top 0.406: IC9.2 57.66,60.3 C21.1
N$35
  Top 0.406: IC6.7 57.63,32.22 C36.1
N$36
  Top 0.406: IC6.2 57.63,43.78 C35.1
N$37
  Top 0.406: IC6.8 63.3,34.77 J7.3
N$38
  Top 0.406: IC6.1 58.91,39.09 60,38 J7.2
N$39
  Top 0.406: IC7.7 76.14,15.71 C41.1
N$40
  Top 0.406: IC7.2 76.14,27.29 C40.1
N$41
  Top 0.406: IC7.8 81.81,18.27 J8.3
N$42
  Top 0.406: IC7.1 77.41,22.59 78.5,21.5 J8.2
N$43
  Top 0.406: IC8.7 76.14,32.22 C46.1
N$44
  Top 0.406: IC8.2 76.14,43.78 C45.1
N$45
  Top 0.406: IC8.8 81.81,34.77 J9.3
N$46
  Top 0.406: IC8.1 77.41,39.09 78.5,38 J9.2
N$47
  Top 0.406: R17.1 9.9,34.54 IC11.1
N$48
  Top 0.406: IC11.3 5.41,31.86 J12.1
N$49
  Top 0.406: IC11.2 5.87,33.13 J12.2
N$50
  Top 0.406: R21.1 9.9,22.04 IC12.1
N$51
  Top 0.406: IC12.3 5.41,19.36 J13.1
N$52
  Top 0.406: IC12.2 5.87,20.64 J13.2
N$53
  Top 0.305: R18.1 25.5,48.5 21.75,44.75 21.75,34.5 24.5,31.75 24.5,31.5 24.82,31.18 U$2.6
N$54
  Top 0.305: U$2.13 20.93,16.57 22,15.5 R22.1
N$55
  Top 0.305: R23.1 25,53 23.5,51.5 23.5,48.75 21.25,46.5 21.25,34.25 23.52,31.98 U$2.8
N$56  (via drill 0.3)
  Top 0.305: R24.1 28.75,65 v27.25,66.5 | U$2.10 22.23,32.52 20.75,34 20.75,47.25 v22.5,49
  Bottom 0.305: v22.5,49 22.5,53 22,53.5 22,64.5 24,66.5 v27.25,66.5
N$57  (via drill 0.3)
  Top 0.305: v24,69.5 R25.1 | v21,49 20,48 20,39.5 20.25,39.25 20.25,33.75 20.93,33.08 U$2.12
  Bottom 0.305: v21,49 21,66.5 v24,69.5
N$58
  Top 0.305: U$2.15 22.23,20.77 23,20 R26.1
N$59  (via drill 0.3)
  Top 0.305: U$2.17 23.52,23.02 v23.5,23 | R27.1 29.5,32 28.5,33 v25.75,33
  Bottom 0.305: v23.5,23 23.5,32.5 24,33 v25.75,33
N$60  (via drill 0.3)
  Top 0.305: U$2.19 24.82,23.18 v25,23 | v25.75,36.5 R28.1
  Bottom 0.305: v25,23 25.5,23.5 25.5,29.5 26.5,30.5 26.5,34 25.75,34.75 v25.75,36.5
POST_L
  Top 0.406: R15.1 40,65.1 40,66 40.37,66.36 U$4.6 40.37,69.64 40,70 36.5,70 34.4,67.9 R4.2 R24.2
POST_R
  Top 0.406: R16.1 40,32.1 40,33 40.37,33.37 U$6.6 40.37,36.63 40,37 35.5,37 34.4,35.9 R7.2 R27.2
RESET  (via drill 0.3)
  Top 0.305: U$1.23 26.93,58.58 26,59.5 19,59.5 v18,60.5 | U$2.23 27.43,25.82 26.75,26.5 19,26.5 v17.75,27.75
  Bottom 0.305: JP1.5 19,73.84 19,68.5 18,67.5 v18,60.5 18.75,59.75 18.75,52.25 17.75,51.25 v17.75,27.75
SCLK  (via drill 0.3)
  Top 0.305: U$2.1 28.07,31.43 27.5,32 25.75,32 22.75,35 22.75,37 v26.5,40.75 | v26.5,67.75 26.5,65.5 27.57,64.42 | U$1.1 27.57,64.42 | 28.25,63.75 v28.5,63.5 27.57,64.42
  Bottom 0.305: v26.5,40.75 27.5,41.75 27.5,56.5 28.5,57.5 v28.5,63.5 | JP1.1 28,69.25 v26.5,67.75
SDO  (via drill 0.3)
  Top 0.305: U$2.3 26.77,30.73 26.5,31 26,31 22.25,34.75 22.25,43.75 v26,47.5 | U$1.22 26.27,56.23 v26.5,56
  Bottom 0.305: v26.5,56 26.5,48 v26,47.5
SDO1  (via drill 0.3)
  Top 0.305: U$2.22 26.77,25.73 26.5,26 18.5,26 v16.75,27.75 | JP1.3 19.92,72 v16.25,72
  Bottom 0.305: v16.75,27.75 16.75,37 17.25,37.5 17.25,67 16.25,68 v16.25,72
SEND_L
  Top 0.406: R11.1 41.63,77.47 U$4.2 41.63,72.14 40.5,71 R5.2 R25.2
SEND_R
  Top 0.406: R13.1 41.63,44.47 U$6.2 41.63,39.63 40,38 R8.2 R28.2
SYNC  (via drill 0.3)
  Top 0.305: U$1.24 27.57,59.42 26.5,60.5 v19.5,60.5 | U$2.24 28.07,25.93 27,27 19.5,27 v18.75,27.75
  Bottom 0.305: JP1.4 19.5,74.12 v19.5,60.5 19.5,52 19,51.5 19,39.75 18.75,39.5 v18.75,27.75
VCC  (via drill 1)
  Top 0.305: U$1.2 26.93,62.08 27.5,61.5 C5.2 | U$2.2 27.43,29.07 28,28.5 C52.2
  Top 0.406: IC5.7 13.87,53.63 13.5,54 13.5,56.6 C10.1 | IC1.7 13.87,66.14 13.5,66.5 13.5,69.1 C1.1 | U$3.8 44.62,51.27 C19.2 | U$4.8 44.62,67.77 C14.2 | U$5.8 44.62,18.27 C6.2 | IC11.7 14.37,33.13 14,33.5 14,36.35 C47.1 | IC12.7 14.37,20.64 14,21 14,23.85 C49.1 | U$6.8 44.62,34.77 C27.2 | IC2.6 56.37,69.64 55.85,70.15 C7.2 | IC4.6 74.86,69.64 74.35,70.15 C28.2 | IC9.6 56.38,53.12 55.85,53.65 C3.2 | IC3.6 74.86,53.13 74.35,53.65 C15.2 | IC6.6 56.37,36.63 56,37 53.15,37 C33.2 | IC10.6 56.38,20.11 55.85,20.65 C23.2 | IC7.6 74.86,20.14 74.35,20.65 C38.2 | IC8.6 74.86,36.63 74.35,37.15 C43.2
  Top 1.016: C1.1 13.65,71.35 v13.5,71.5 | C10.1 13.65,58.85 v13.5,59 | C49.1 14.15,25.85 v14,26 | C47.1 14.15,38.35 v14,38.5 | C52.2 30.15,30.15 v30.5,30.5 | C5.2 29.65,63.15 v30,63.5 | v45,33 C27.2 | v45,49.5 C19.2 | v45,66 C14.2 | C7.2 51.15,70.15 v51,70 | C28.2 69.65,70.15 v69.5,70 | C33.2 51.15,37.15 v51,37 | C43.2 69.65,37.15 v69.5,37 | C3.2 50.65,53.65 v50.5,53.5 | C15.2 69.65,53.65 v69.5,53.5 | v45,8.5 v45,16.5 C6.2 | v45,8.5 42.5,6 29.75,6 29.12,6.62 | v45,8.5 47,8.5 48,9.5 48,18 50,20 v51,20 51.65,20.65 C23.2 | v61.5,9.5 67,15 67,18.5 68.5,20 v69.5,20 70.15,20.65 C38.2 | v32,11 32,9.5 29.12,6.62 | 29.12,6.62 29,6.5 26.73,6.5 J1.1
  Bottom 1.016: v30,63.5 31.5,62 31.5,31.5 v30.5,30.5 32,29 v32,11 | v45,16.5 v45,33 v45,49.5 42.25,52.25 42.25,64.5 43.75,66 v45,66 | v51,70 50,70 46.75,66.75 46.75,65.25 45,63.5 45,62.25 47.25,60 48.5,60 52.5,56 52.5,54.15 52,53.65 50.65,53.65 v50.5,53.5 50,53.5 48,51.5 48,44.5 53,39.5 53,37.5 52.5,37 v51,37 50,37 48,35 48,27.5 53,22.5 53,20.5 52.5,20 v51,20 | v69.5,70 69,70 67.5,68.5 67.5,60 71.5,56 71.5,54.15 71,53.65 69.65,53.65 v69.5,53.5 68.5,53.5 67.5,52.5 67.5,43.5 71.5,39.5 71.5,37.65 71,37.15 69.65,37.15 v69.5,37 68.5,37 67.5,36 67.5,26.5 71.5,22.5 71.5,21 70.5,20 v69.5,20 | v61.5,9.5 46,9.5 v45,8.5 | v13.5,71.5 v13.5,59 14,58.5 v14,38.5 14,31 15.5,29.5 15.5,27.5 v14,26 18.5,26 19.5,25 19.5,14 22,11.5 24.25,11.5 26.62,9.13 J1.1
VEE  (via drill 1)
  Top 0.305: U$1.21 25.62,55.38 26,55 27,55 28.25,56.25 28.25,58.25 28.5,58.5 C4.1 | U$2.21 26.12,23.12 26.5,22.75 28.25,22.75 28.75,23.25 28.75,25.25 29,25.5 C51.1
  Top 0.406: IC1.4 9.27,61.87 C2.1 | C11.1 9.15,50.98 IC5.4 | U$3.4 37.12,57.73 C20.1 | U$4.4 37.12,74.23 C37.1 | U$5.4 37.12,24.73 C32.1 | C48.1 9.65,30.48 IC11.4 | C50.1 9.65,17.98 IC12.4 | C42.1 38.98,41.35 U$6.4 | IC4.5 71.92,67.77 C29.1 | IC2.5 53.41,67.77 C8.1 | IC9.5 53.16,51.27 C12.1 | IC3.5 71.92,51.27 C16.1 | IC6.5 53.41,34.77 C34.1 | IC7.5 71.92,18.27 C39.1 | IC8.5 71.92,34.77 C44.1 | IC10.5 53.35,18.2 C24.1
  Top 1.016: C2.1 9.15,59.65 v9,59.5 | C11.1 9.15,47.15 v9,47 | C50.1 9.65,14.15 v9.5,14 17.11,6.39 J1.3 18.69,3.56 19.5,2.75 50.5,2.75 53.62,5.88 | C48.1 9.65,26.65 v9.5,26.5 | C4.1 29.65,56.65 v29.5,56.5 | C42.1 v37,43.5 | C20.1 v37,60 | C37.1 v37,76.5 | C8.1 51.15,67.35 v51,67.5 | C29.1 69.65,67.35 v69.5,67.5 | C34.1 50.65,34.35 v50.5,34.5 | C44.1 69.15,34.35 v69,34.5 | C12.1 50.65,50.85 v50.5,51 | C16.1 69.65,50.85 v69.5,51 | C51.1 30.15,23.65 v30,23.5 | C32.1 v37,27 | C39.1 69.65,17.85 v69.5,18 69.5,11.5 64,6 53.75,6 53.62,5.88 | C24.1 51.15,17.85 v51,18 51,8.5 53.62,5.88
  Bottom 1.016: v9,59.5 v9,47 9,27 v9.5,26.5 v9.5,14 | v29.5,56.5 28.5,55.5 28.5,24.5 29.5,23.5 v30,23.5 30,4 | v37,76.5 v37,60 v37,43.5 v37,27 37,11 30,4 | v69.5,67.5 69.5,60.5 73,57 73,52 72,51 v69.5,51 69.5,44 73,40.5 73,35.85 C44.1 69.15,34.35 v69,34.5 69,28 73.5,23.5 73.5,19.85 C39.1 69.65,17.85 v69.5,18 | v51,18 53,18 54.5,19.5 54.5,23.5 49.5,28.5 49.5,33.5 v50.5,34.5 52.5,34.5 54.5,36.5 54.5,40.5 49.5,45.5 49.5,50 v50.5,51 50.65,50.85 C12.1 54.5,52.6 54.5,56.5 51.75,59.25 51.75,66.75 v51,67.5 | J1.3 18.69,3.56 19.5,2.75 28.75,2.75 30,4

### Text on the board
tNames: RESET / SYNC / SDO / SDI / SCLK | SND(L) | PST(L) | G | G | C | C | G | H | H | C | H | B(L) | A(L) | G | G | G | C | C | C | H | H | H | SND(R) | PST(R) | G | G | C | C | G | H | H | C | H | B(R) | A(R) | G | G | G | C | C | C | H | H | H | +15V | +15V | XFADER_ASSIGN | CC-BY SA 4.0 | v0.1/20140521 | AGND